# Altium schematic sheet Master.SchDoc
size A4; Organization: WMG; Address1: University of Warwick; Address2: WM355; SheetNumber: 1; SheetTotal: 3
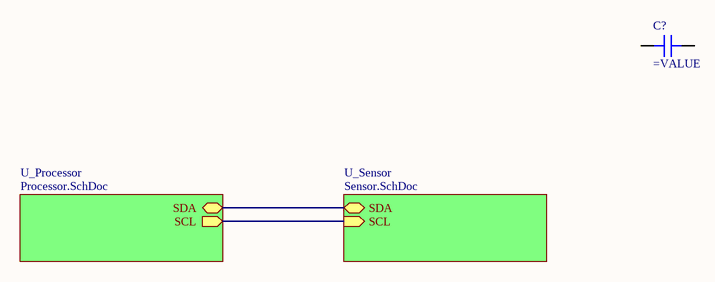
[diagram p0: Master.SchDoc]

## Parts
C?  (no value)  [CAP 0201_0603]

## Sub-sheets
U_Processor = Processor.SchDoc: SDA (bidir), SCL (out)
U_Sensor = Sensor.SchDoc: SDA (bidir), SCL (in)

## Nets
(unnamed): sheet U_Sensor/SDA, sheet U_Processor/SDA
(unnamed): sheet U_Sensor/SCL, sheet U_Processor/SCL

Not connected (* = marked no-connect by the designer): C? 1 2

## Notes on the sheet
- Title
- Size:
- Date:
- A4
- Number:
- Time:
- Revision:
- Sheet
- of
- File:

## Library data of the parts
C? = Capacitor: SMT Capacitor